# EAGLE design segment (EAGLE 7.1.0)
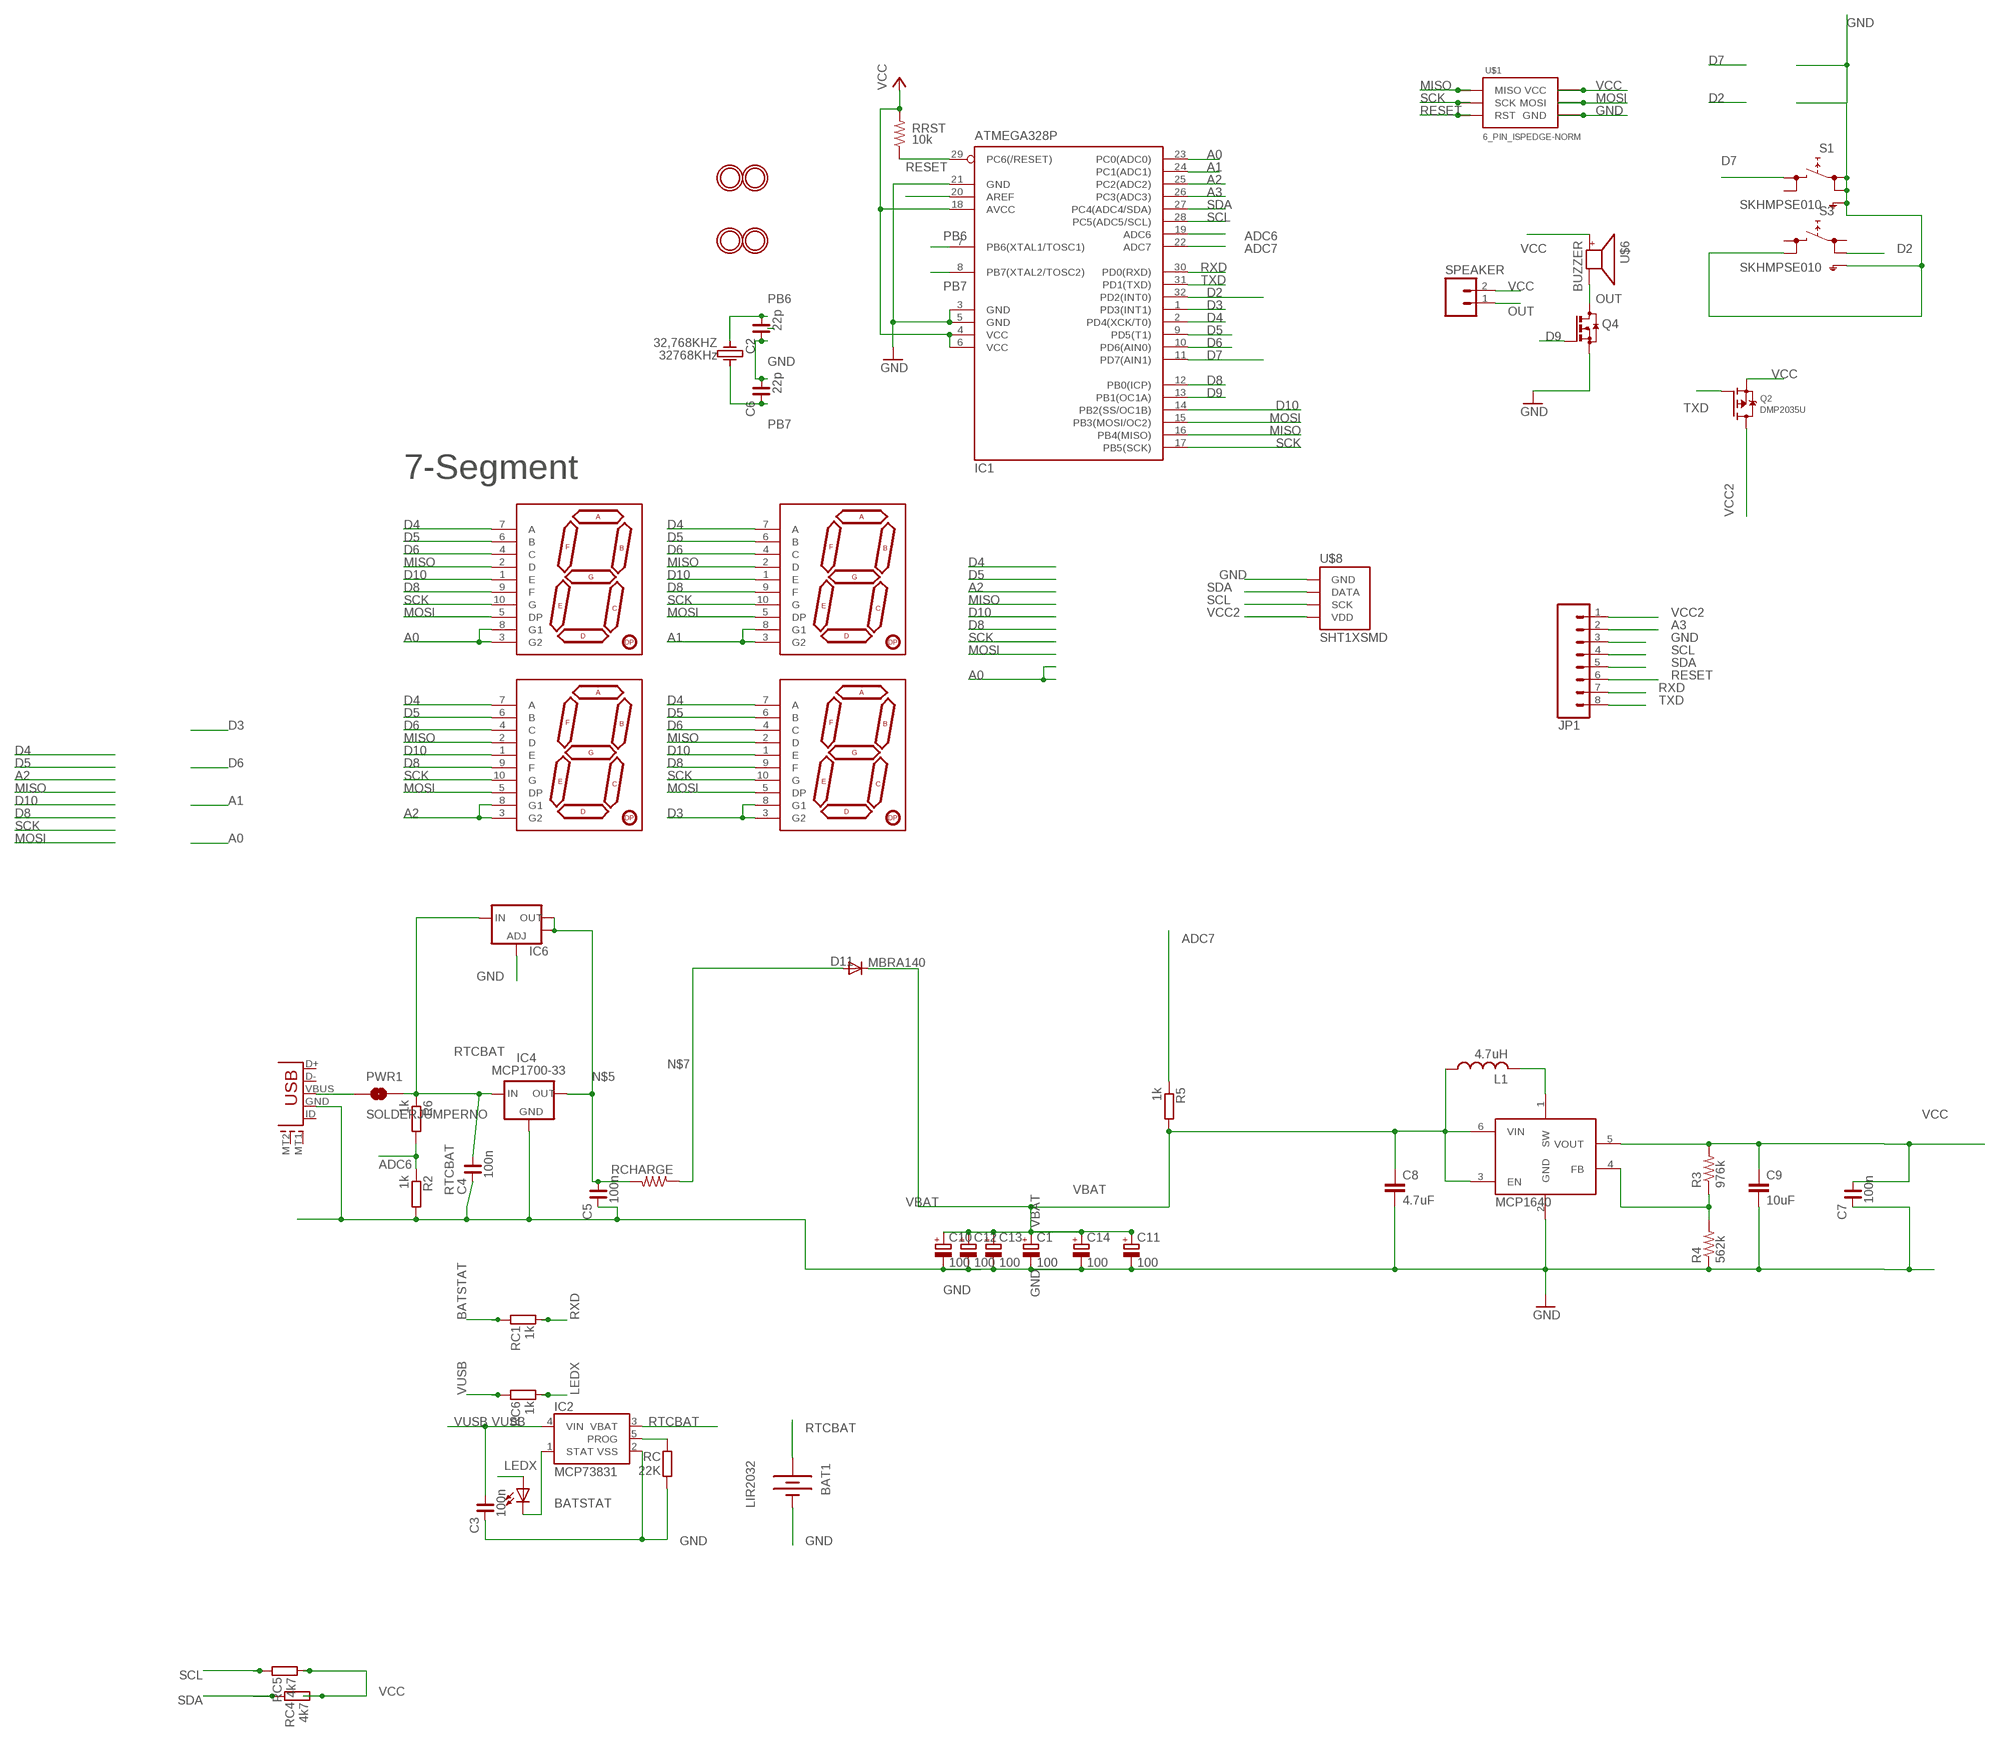
[diagram p0: schematic, sheet 1]

## Parts
32,768KHZ  32768KHz  CRYSTALL  [KX-327LT]
BAT1  LIR2032  BATTERYBATTCOM_20MM_PTH_SMT  [BATTCOM_20MM_PTH_SMT]
C1  100  CPOL-EUTT5D11L  [TT5D11L]
C2  22p  C_0603  [C0603]
C3  100n  C_0603  [C0603]
C4  100n  C_0603  [C0603]
C5  100n  C_0603  [C0603]
C6  22p  C_0603  [C0603]
C7  100n  C_0603  [C0603]
C8  4.7uF  CAP0805  [0805]
C9  10uF  CAP0805  [0805]
C10  100  CPOL-EUTT5D11L  [TT5D11L]
C11  100  CPOL-EUTT5D11L  [TT5D11L]
C12  100  CPOL-EUTT5D11L  [TT5D11L]
C13  100  CPOL-EUTT5D11L  [TT5D11L]
C14  100  CPOL-EUTT5D11L  [TT5D11L]
CHG  0805  LEDCHIPLED_0603  [CHIPLED_0603]
D11  MBRA140  DIODESOD  [SOD-323]
DIG1  7-SEGMENT-DISPLAY-1"-RED  [7-SEGMENT-SMD]
DIG2  7-SEGMENT-DISPLAY-1"-RED  [7-SEGMENT-SMD]
DIG3  7-SEGMENT-DISPLAY-1"-RED  [7-SEGMENT-SMD]
DIG4  7-SEGMENT-DISPLAY-1"-RED  [7-SEGMENT-SMD]
IC1  ATMEGA328P  MEGA8-AI  [TQFP32-08]
IC2  MCP73831  [SOT23-5]
IC4  MCP1700-33  MCP1700SOT233  [SOT23]
IC6  V_REG_LM1117SOT223  [SOT223]
JP1  M08NO_SILK  [1X08_PIN1_NO_SILK]
L1  4.7uH  LLQH44P_P0  [LQH44]
PWR1  SOLDERJUMPERNO  [SJ_2S-NO]
Q2  DMP2035U  MOSFET-PWIDE  [SOT23-WIDE]
Q4  BSS123  [SOT23]
R2  1k  R-EU_R0603  [R0603]
R3  976k  RESISTOR0603-RES  [0603-RES]
R4  562k  RESISTOR0603-RES  [0603-RES]
R5  1k  R-EU_R0603  [R0603]
R6  1k  R-EU_R0603  [R0603]
RC  22K  R-EU_R0603  [R0603]
RC1  1k  R-EU_R0603  [R0603]
RC4  4k7  R-EU_R0603  [R0603]
RC5  4k7  R-EU_R0603  [R0603]
RC6  1k  R-EU_R0603  [R0603]
RCHARGE  RESISTOR1206  [1206]
RRST  10k  R-US_R0603  [R0603@1]
S1  SKHMPSE010  [SKHMPXE010]
S3  SKHMPSE010  [SKHMPXE010]
SPEAKER  M02PTH  [1X02]
U2  MCP1640  [SOT23-6]
U$1  6_PIN_ISPEDGE-NORM  [6_PIN_EDGE]
U$2  MOUNTINGHOLE2.0  [MOUNTINGHOLE_2.0_PLATED]
U$3  MOUNTINGHOLE2.0  [MOUNTINGHOLE_2.0_PLATED]
U$4  MOUNTINGHOLE2.0  [MOUNTINGHOLE_2.0_PLATED]
U$5  MOUNTINGHOLE2.0  [MOUNTINGHOLE_2.0_PLATED]
U$6  BUZZER  [SMT-8585-BUZZER]
U$8  SHT1XSMD  [SHT1X]
USB2  USB-MICROBLARGEPAD  [USB-MICROB_LARGEPAD]

## Nets
A0: DIG1.3(G2) DIG1.8(G1) IC1.23(PC0(ADC0))
A1: DIG2.3(G2) DIG2.8(G1) IC1.24(PC1(ADC1))
A2: DIG3.3(G2) DIG3.8(G1) IC1.25(PC2(ADC2))
A3: IC1.26(PC3(ADC3)) JP1.2
ADC6: IC1.19(ADC6) R2.1 R6.2
ADC7: IC1.22(ADC7) R5.1
AREF: IC1.20(AREF)
BATSTAT: CHG.C IC2.1(STAT) RC1.2
D2: IC1.32(PD2(INT0)) S3.2(1.2)
D3: DIG4.3(G2) DIG4.8(G1) IC1.1(PD3(INT1))
D4: DIG1.7(A) DIG2.7(A) DIG3.7(A) DIG4.7(A) IC1.2(PD4(XCK/T0))
D5: DIG1.6(B) DIG2.6(B) DIG3.6(B) DIG4.6(B) IC1.9(PD5(T1))
D6: DIG1.4(C) DIG2.4(C) DIG3.4(C) DIG4.4(C) IC1.10(PD6(AIN0))
D7: IC1.11(PD7(AIN1)) S1.3(2.1)
D8: DIG1.9(F) DIG2.9(F) DIG3.9(F) DIG4.9(F) IC1.12(PB0(ICP))
D9: IC1.13(PB1(OC1A)) Q4.1(G)
D10: DIG1.1(E) DIG2.1(E) DIG3.1(E) DIG4.1(E) IC1.14(PB2(SS/OC1B))
GND [pwr]: BAT1.P$1(-) C1.- C2.2 C3.2 C4.2 C5.2 C6.1 C7.2 C8.2 C9.2 C10.- C11.- C12.- C13.- C14.- IC1.3(GND) IC1.5(GND) IC1.21(GND) IC2.2(VSS) IC4.1(GND) IC6.1(ADJ) JP1.3 Q4.2(S) R2.2 R4.1 RC.1 S1.1(1.1) S1.2(1.2) S1.5(SH) S3.4(2.2) S3.5(SH) U2.2(GND) U$1.6(GND) U$8.1(GND) USB2.GND
LEDX: CHG.A RC6.1
MISO: DIG1.2(D) DIG2.2(D) DIG3.2(D) DIG4.2(D) IC1.16(PB4(MISO)) U$1.1(MISO)
MOSI: DIG1.5(DP) DIG2.5(DP) DIG3.5(DP) DIG4.5(DP) IC1.15(PB3(MOSI/OC2)) U$1.4(MOSI)
N$2: IC2.5(PROG) RC.2
N$4: L1.P$2 U2.1(SW)
N$5: C5.1 IC4.2(OUT) IC6.2(OUT) IC6.4(OUT) RCHARGE.2
N$6: R3.1 R4.2 U2.4(FB)
N$7: D11.2(A) RCHARGE.1
OUT: Q4.3(D) SPEAKER.1 U$6.-
PB6: 32,768KHZ.4 C2.1 IC1.7(PB6(XTAL1/TOSC1))
PB7: 32,768KHZ.1 C6.2 IC1.8(PB7(XTAL2/TOSC2))
RESET: IC1.29(PC6(/RESET)) JP1.6 RRST.1 U$1.5(RST)
RTCBAT: BAT1.P$2(+) C4.1 IC2.3(VBAT) IC4.3(IN) IC6.3(IN) PWR1.2 R6.1
RXD: IC1.30(PD0(RXD)) JP1.7 RC1.1
SCK: DIG1.10(G) DIG2.10(G) DIG3.10(G) DIG4.10(G) IC1.17(PB5(SCK)) U$1.3(SCK)
SCL: IC1.28(PC5(ADC5/SCL)) JP1.4 RC5.2 U$8.3(SCK)
SDA: IC1.27(PC4(ADC4/SDA)) JP1.5 RC4.2 U$8.2(DATA)
TXD: IC1.31(PD1(TXD)) JP1.8 Q2.1(G)
VBAT [pwr]: C1.+ C8.1 C10.+ C11.+ C12.+ C13.+ C14.+ D11.1(C) L1.P$1 R5.2 U2.3(EN) U2.6(VIN)
VCC [vcc]: C7.1 C9.1 IC1.4(VCC) IC1.6(VCC) IC1.18(AVCC) Q2.2(S) R3.2 RC4.1 RC5.1 RRST.2 SPEAKER.2 U2.5(VOUT) U$1.2(VCC) U$6.+
VCC2: JP1.1 Q2.3(D) U$8.4(VDD)
VUSB: C3.1 IC2.4(VIN) PWR1.1 RC6.2 USB2.VBUS
Unconnected: S1.4(2.2) S3.1(1.1) S3.3(2.1) USB2.D+ USB2.D- USB2.ID USB2.MT1(SHEILD1) USB2.MT2(SHEILD2)

## Notes on the sheet
- 7-Segment

## Library data of the parts
32,768KHZ = es:CRYSTALL
BAT1 = SparkFunNew:BATTERY: Battery Holders Various common sizes : AA, AAA, 20mm coin cell and 12mm coin cell.
C1 C10-C14 = resistor:CPOL-EU: POLARIZED CAPACITOR, European symbol
C2-C7 = rc-master-smd:C_: NON-POLARIZED CAP
C8 C9 = SparkFun:CAP: Capacitor Standard 0603 ceramic capacitor, and 0.1" leaded capacitor.
CHG = led:LED: LED OSRAM: - CHIPLED LG R971, LG N971, LY N971, LG Q971, LY Q971, LO R971, LY R971 LH N974, LH R974 LS Q976, LO Q976, LY Q976 LO Q996 - Hyper CHIPLED LW Q18S LB Q993, LB Q99A, LB R99A - SideLED LS A670, LO A670, LY A670, LG A670, LP A670 LB A673, LV A673, LT A673, LW A673 LH A674 LY A675 LS A676, LA A676, LO A676, LY A676, LW A676 LS A679, LY A679, LG A679 - Hyper Micro SIDELED® LS Y876, LA Y876, LO Y876, LY Y876 LT Y87S - SmartLED LW L88C, LW L88S LB L89C, LB L89S, LG L890 LS L89K, LO L89K, LY L89K LS L896, LA L896, LO L896, LY L896 - TOPLED LS T670, LO T670, LY T670, LG T670, LP T670 LSG T670, LSP T670, LSY T670, LOP T670, LYG T670 LG T671, LOG T671, LSG T671 LB T673, LV T673, LT T673, LW T673 LH T674 LS T676, LA T676, LO T676, LY T676, LB T676, LH T676, LSB T676, LW T676 LB T67C, LV T67C, LT T67C, LS T67K, LO T67K, LY T67K, LW E67C LS E67B, LA E67B, LO E67B, LY E67B, LB E67C, LV E67C, LT E67C LW T67C LS T679, LY T679, LG T679 LS T770, LO T770, LY T770, LG T770, LP T770 LB T773, LV T773, LT T773, LW T773 LH T774 LS E675, LA E675, LY E675, LS T675 LS T776, LA T776, LO T776, LY T776, LB T776 LHGB T686 LT T68C, LB T68C - Hyper Mini TOPLED® LB M676 - Mini TOPLED Santana® LG M470 LS M47K, LO M47K, LY M47K Source: http://www.osram.convergy.de LUXEON: - LUMILED® LXK2-PW12-R00, LXK2-PW12-S00, LXK2-PW14-U00, LXK2-PW14-V00 LXK2-PM12-R00, LXK2-PM12-S00, LXK2-PM14-U00 LXK2-PE12-Q00, LXK2-PE12-R00, LXK2-PE12-S00, LXK2-PE14-T00, LXK2-PE14-U00 LXK2-PB12-K00, LXK2-PB12-L00, LXK2-PB12-M00, LXK2-PB14-N00, LXK2-PB14-P00, LXK2-PB14-Q00 LXK2-PR12-L00, LXK2-PR12-M00, LXK2-PR14-Q00, LXK2-PR14-R00 LXK2-PD12-Q00, LXK2-PD12-R00, LXK2-PD12-S00 LXK2-PH12-R00, LXK2-PH12-S00 LXK2-PL12-P00, LXK2-PL12-Q00, LXK2-PL12-R00 Source: www.luxeon.com KINGBRIGHT: KA-3528ASYC Source: www.kingbright.com
D11 = SparkFun:DIODE: Diode These are standard reverse protection diodes and small signal diodes. SMA package can handle up to about 1A. SOD-323 can handle about 200mA. What the SOD-323 package when ordering, there are some mfgs out there that are 5-pin packages.
DIG1-DIG4 = balto:7-SEGMENT-DISPLAY-1"-RED: 7-Segment Display 1" Red (COM-08546)
IC1 = atmel:MEGA8: MICROCONTROLLER 8 Kbytes FLASH, 1 kbytes SRAM, 512 bytes EEPROM, USART, 6-channel 10 bit ADC, 2-channel 8 bit ADC Pin compatible with Atmega48, ATMega88, ATMega168 Source: avr.lbr; MPN: ATMEGA8-16AU; OC_FARNELL: 9171371; OC_NEWARK: 73M8863
IC2 = SparkFunNew:MCP73831: Microchip's MCP73831 Miniature single cell, fully integrated Li-Ion, Li-polymer charge management controller http://ww1.microchip.com/downloads/en/DeviceDoc/21984a.pdf
IC4 = adafruit:MCP1700: VOLTAGE REGULATOR
IC6 = SparkFun:V_REG_LM1117: Voltage Regulator LM1117 Standard adjustable voltage regulator but in SMD form. Spark Fun Electronics SKU : COM-00595
JP1 = SparkFun-Connectors:M08: Header 8 Standard 8-pin 0.1" header. Use with straight break away headers (SKU : PRT-00116), right angle break away headers (PRT-00553), swiss pins (PRT-00743), machine pins (PRT-00117), and female headers (PRT-00115).
L1 = karlnet-parts:L
PWR1 = SparkFun:SOLDERJUMPER: Solder Jumper Standard SMD solder jumper. Used to automate production. Two varients : Normally Open and Normally Closed are the same, but have different paste layers. NC will have a large amount of paste and should jumper during reflow.
Q2 = microbuilder:MOSFET-P: P-Channel Mosfet LEGEND VDS: Voltage Drain-Source ID: Drain Current RDS(ON): Drain-Source On-State Resistance VGS(TH): Gate-Source Threshold Voltage CISS: Drain-Source Input Capacitance SOT-23 Name VDS ID RDS(ON) VGS(TH) CISS Order Number IRLML5103 30V 760mA 600 mOhm -- 75pF @ 25V Digikey: IRLML5103PBFCT-ND IRLML6401 12V 4.3A 50 mOhm 950mV @ 250µA 830pF @ 10V Digikey: IRLML6401PBFTR-ND NTR0202PL 20V 400mA 800 mOhm 2.3V @ 250uA 70pF @ 5V Digikey: NTR0202PLT1GOSTR-ND NTR4101PT1G 20V 1.8A 85 mOhm 1.2V @ 250uA 675pF @ 10V Digikey: NTR4101PT1GOSCT-ND DMP2004K 20V 600mA 900 mOhm 1V @ 250uA 175pF @ 16V Digikey: DMP2004KDICT-ND PMV65XP 20V 3.9A 76 mOhm 950mV @ 1mA 725pF @ 20V Digikey: 568-2358-2-ND TO-252 Name VDS ID RDS(ON) VGS(TH) CISS Order Number AOD417 30V 25A 34 mOhm 3V @ 250µA 920pF @ 15V Digikey: 785-1106-2-ND
Q4 = transistor-small-signal:BSS123: N-CHANNEL MOS FET
R2 R5 R6 RC RC1 RC4-RC6 = rcl:R-EU_: RESISTOR, European symbol
R3 R4 RCHARGE = SparkFun:RESISTOR: Resistor Basic schematic elements and footprints for 0603, 1206, and PTH resistors.
RRST = rcl:R-US_: RESISTOR, American symbol
S1 S3 = switch:SKHMP*E010: 6.2 X 6.5mm TACT Switch (SMD) Source: http://www3.alps.co.jp/WebObjects/catalog.woa/PDF/E/Switch/Tact/SKHM/SKHM.PDF
SPEAKER = SparkFun-Connectors:M02: Header 2 Standard 2-pin 0.1" header. Use with straight break away headers (SKU : PRT-00116), right angle break away headers (PRT-00553), swiss pins (PRT-00743), machine pins (PRT-00117), and female headers (PRT-00115). Molex polarized connector foot print use with SKU : PRT-08233 with associated crimp pins and housings.
U2 = karlnet-parts:MCP1640: MCP1623, 1624, 1640/B/C/D pwm/pfm or pwm only DC/DC converters, in SOT-23
U$1 = ppeter:6_PIN_ISP: AVR 6 PIN ISP header Edge connector normal layout
U$2-U$5 = microbuilder:MOUNTINGHOLE: Mounting Hole
U$6 = adafruit:BUZZER
U$8 = SparkFun-Sensors:SHT1X: SHT1x Humdity Sensor Sensirion humdity sensor. Schematic element and footprint proven. Spark Fun Electronics SKU : COM-08227
USB2 = zak:USB-MICROB

## Net classes
0 default: width 0.229 mm, drill 0.356 mm, clearance 0.229 mm
1 vcc: width 0.254 mm, drill 0.356 mm, clearance 0.229 mm
2 pwr: width 0.305 mm, drill 0.356 mm, clearance 0.229 mm

## Board
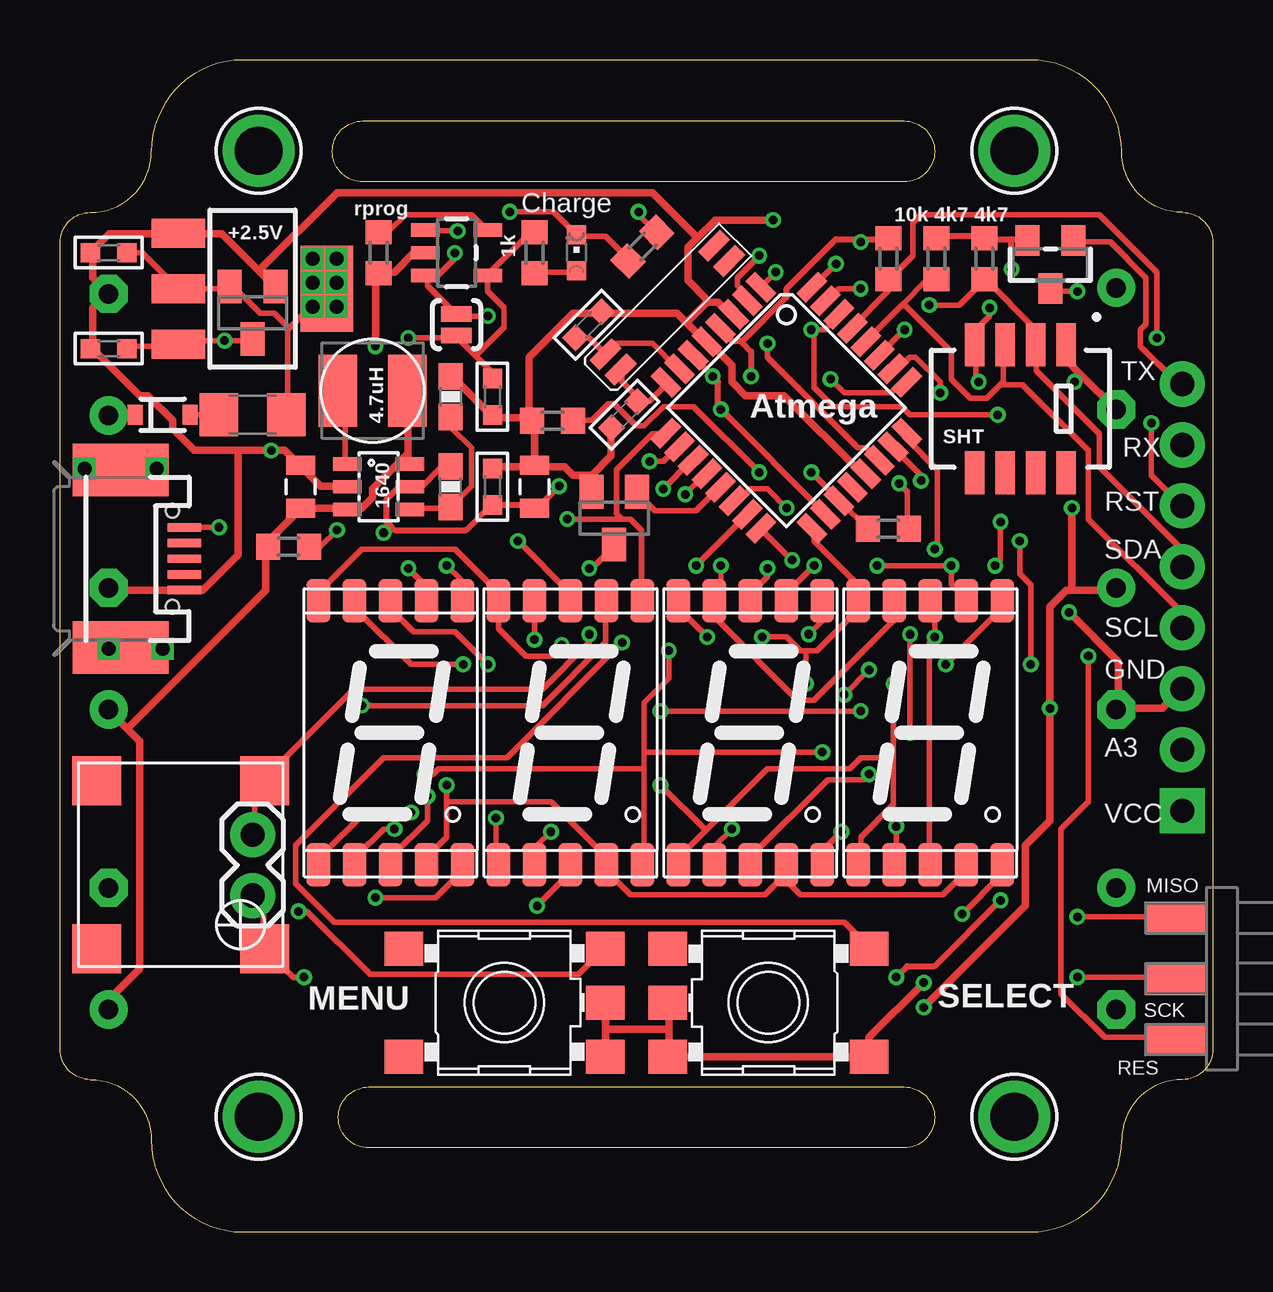
[diagram p1: board, top side]
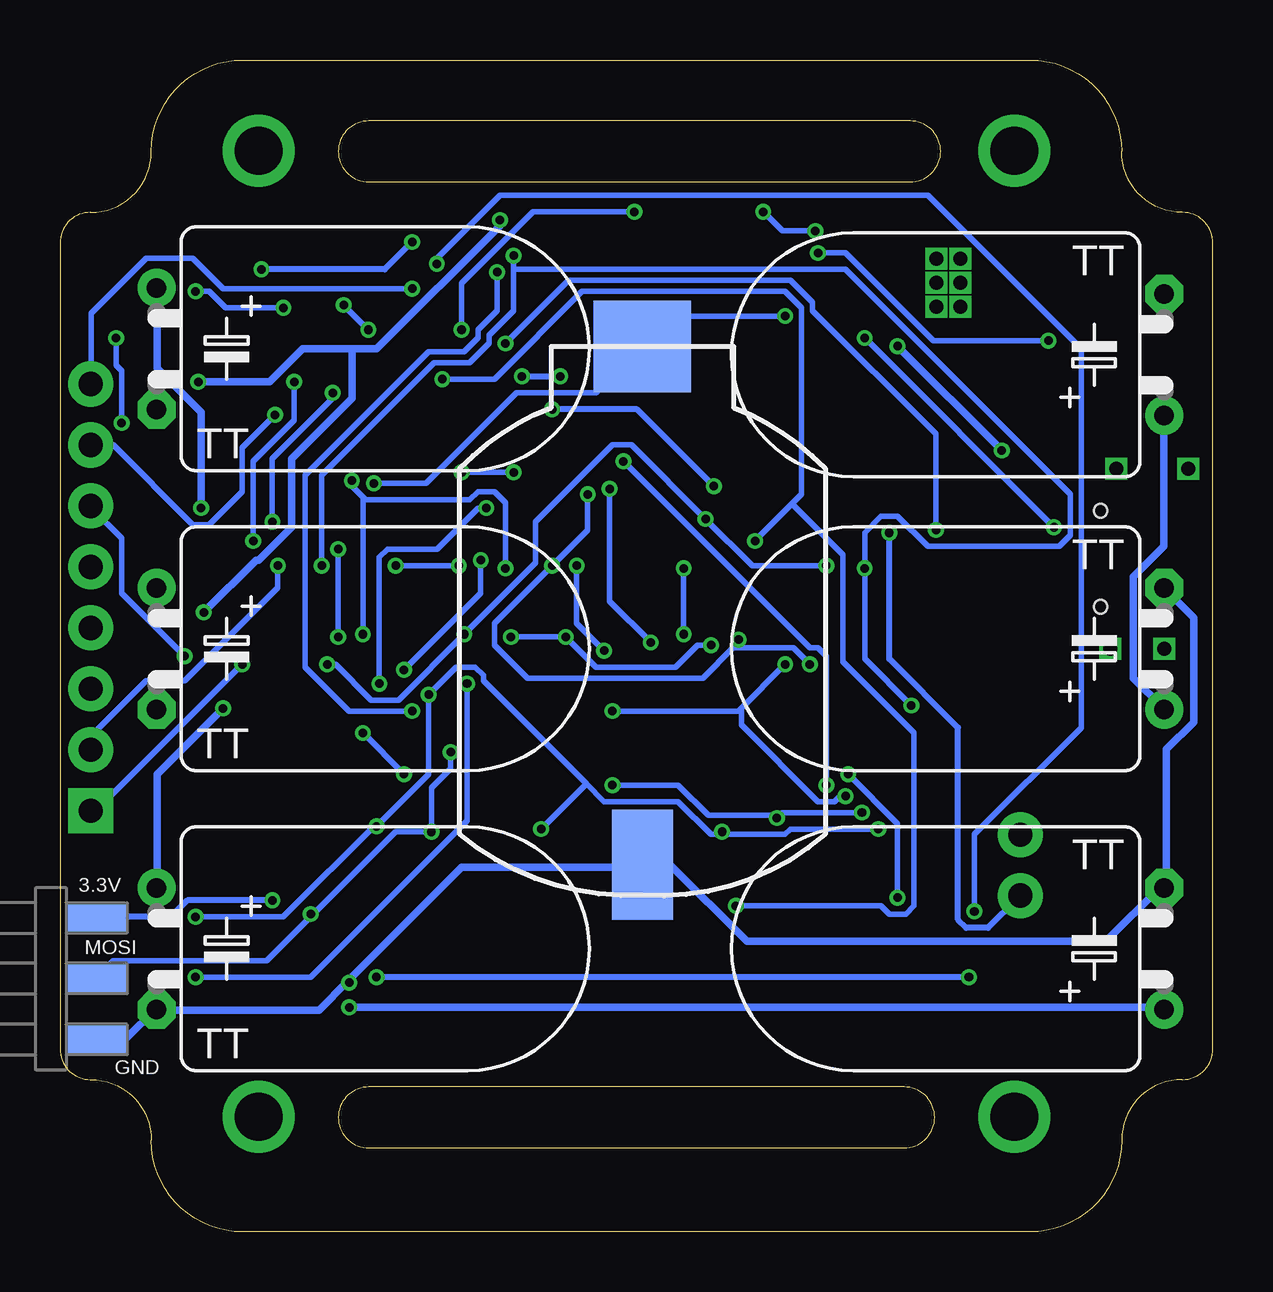
[diagram p2: board, bottom side, seen from below]

Size 48.06 x 48.83 mm. Coordinates in mm from the lower left corner, seen from the top.
Outline: 46.79,42.48 arc-90 48.06,41.21 48.06,7.62 arc-90 46.79,6.35 arc90 44.25,3.81 arc-90 40.44,0 7.62,0 arc-90 3.81,3.81 arc90 1.27,6.35 arc-90 0,7.62 0,41.21 arc-90 1.27,42.48 arc90 3.81,45.02 arc-90 7.62,48.83 40.44,48.83 arc-90 44.25,45.02 arc90 46.79,42.48
Outline: 35.19,46.29 arc-90 36.46,45.02 arc-90 35.19,43.75 12.62,43.75 arc-90 11.35,45.02 arc-90 12.62,46.29 35.19,46.29
Outline: 35.19,6.04 arc-90 36.46,4.77 arc-90 35.19,3.5 12.87,3.5 arc-90 11.6,4.77 arc-90 12.87,6.04 35.19,6.04
Copper layers (1*16): Top 0.035mm / dielectric 1.5mm / Bottom 0.035mm
Design rules "ITEADstudio_DRC": minimum track width 6mil, minimum drill 12mil, track to track 6mil, track to pad 6mil, pad to pad 6mil, via to via 6mil, smd to smd 0mil, copper to edge 10mil, drill to drill 10mil, minimum pad ring 10mil, minimum via ring 6mil, stop-mask expansion 2mil, vias tented up to drill 100mil, thermal gap 10mil
tRestrict: area -0.5,43.5 to 49.8,52.1; area 0.8,-6.7 to 48.5,6
bRestrict: area -2,43.5 to 56,54.3; area -5,-2.5 to 54.3,6

### Footprints (pad centres in the part's own frame; a part is rotated, then mirrored left to right if it is on the bottom)
KX-327LT = smd 1.3 x 0.6: 1 -3.2,-0.5; 2 3.2,-0.5; 3 3.2,0.4; 4 -3.2,0.4
BATTCOM_20MM_PTH_SMT = smd 4.572 x 2.54: P$1 0,0 | smd 3.81 x 4.064: P$2 21.59,0
TT5D11L = drill 0.813 pad 1.6: + -2.54,0 | drill 0.813 pad 1.6 octagon: - 2.54,0
C0603 = smd 0.8 x 0.8: 1 -0.762,0; 2 0.762,0
0805 = smd 0.8 x 1.2: 1 -0.9,0; 2 0.9,0
CHIPLED_0603 = smd 0.8 x 0.8: A 0,-0.75; C 0,0.75
SOD-323 = smd 0.63 x 0.83: 1 -1.15,0; 2 1.15,0
7-SEGMENT-SMD = smd 1 x 1.8: 1 -3,-5.5; 2 -1.5,-5.5; 3 0,-5.5; 4 1.5,-5.5; 5 3,-5.5; 6 3,5.5; 7 1.5,5.5; 8 0,5.5; 9 -1.5,5.5; 10 -3,5.5
TQFP32-08 = smd 1.27 x 0.559: 1 -4.293,2.8; 2 -4.293,2; 3 -4.293,1.2; 4 -4.293,0.4; 5 -4.293,-0.4; 6 -4.293,-1.2; 7 -4.293,-2; 8 -4.293,-2.8; 17 4.293,-2.8; 18 4.293,-2; 19 4.293,-1.2; 20 4.293,-0.4; 21 4.293,0.4; 22 4.293,1.2; 23 4.293,2; 24 4.293,2.8 | smd 0.559 x 1.27: 9 -2.8,-4.293; 10 -2,-4.293; 11 -1.2,-4.293; 12 -0.4,-4.293; 13 0.4,-4.293; 14 1.2,-4.293; 15 2,-4.293; 16 2.8,-4.293; 25 2.8,4.293; 26 2,4.293; 27 1.2,4.293; 28 0.4,4.293; 29 -0.4,4.293; 30 -1.2,4.293; 31 -2,4.293; 32 -2.8,4.293
SOT23-5 = smd 0.55 x 1.2: 1 -0.95,-1.3; 2 0,-1.3; 3 0.95,-1.3; 4 0.95,1.3; 5 -0.95,1.3
SOT23 = smd 1 x 1.4: 1 -0.95,-1.1; 2 0.95,-1.1; 3 0,1.1
SOT223 = smd 1.219 x 2.235: 1 -2.311,-3.099; 2 0,-3.099; 3 2.311,-3.099 | smd 3.6 x 2.2: 4 0,3.099
1X08_PIN1_NO_SILK = drill 1.016 pad 1.88 square: 1 0,0 | drill 1.016 pad 1.88: 2 2.54,0; 3 5.08,0; 4 7.62,0; 5 10.16,0; 6 12.7,0; 7 15.24,0; 8 17.78,0
LQH44 = smd 1.6 x 3: P$1 -1.45,0; P$2 1.45,0
SJ_2S-NO = smd 0.635 x 1.27: 1 -0.45,0; 2 0.45,0
SOT23-WIDE = smd 1 x 1.27: 1 -0.95,-1; 2 0.95,-1; 3 0,1
R0603 = smd 1 x 1.1: 1 -0.85,0; 2 0.85,0
0603-RES = smd 1.1 x 1: 1 -0.85,0; 2 0.85,0
1206 = smd 1.6 x 1.8: 1 -1.4,0; 2 1.4,0
R0603@1 = smd 1 x 1.1: 1 -0.85,0; 2 0.85,0
SKHMPXE010 = smd 1.6 x 1.4: 1 -4.2,2.25; 2 4.2,2.25; 3 -4.2,-2.25; 4 4.2,-2.25; 5 4.2,0
1X02 = drill 1.016 pad 1.88: 1 0,0; 2 2.54,0
SOT23-6 = smd 0.55 x 1.2: 1 -0.95,-1.3; 2 0,-1.3; 3 0.95,-1.3; 4 0.95,1.3; 5 0,1.3; 6 -0.95,1.3
6_PIN_EDGE = smd 1.27 x 2.54: 1 2.54,0; 3 0,0; 5 -2.54,0 | smd 1.27 x 2.54 bottom: 2 2.54,0; 4 0,0; 6 -2.54,0
MOUNTINGHOLE_2.0_PLATED = drill 2 pad 3: P$1 0,0
SMT-8585-BUZZER = smd 2.05 x 2.05: + -3.5,-3.5; - 3.5,-3.5; NC1 -3.5,3.5; NC2 3.5,3.5
SHT1X = smd 1.8 x 0.8: 1 -2.667,1.905; 2 -2.667,0.635; 3 -2.667,-0.635; 4 -2.667,-1.905; 5 2.667,-1.905; 6 2.667,-0.635; 7 2.667,0.635; 8 2.667,1.905
USB-MICROB_LARGEPAD = smd 0.35 x 1.4: D+ 0,2.65; D- -0.65,2.65; GND 1.3,2.65; ID 0.65,2.65; VBUS -1.3,2.65 | smd 2.2 x 4: MT1 -3.7,0; MT2 3.7,0 | hole 0.55: -2,2.15; 2,2.15

### Placement (x,y rotation side)
32,768KHZ  25.28,38.55 45 top
BAT1  23.78,15.3 90 bottom
C1  2.03,36.55 90 bottom
C2  22.03,37.8 45 top
C3  18.03,34.8 270 top
C4  2.03,36.8 180 top
C5  2.03,40.8 180 top
C6  23.53,34.05 45 top
C7  18.03,31.05 90 top
C8  10.03,31.05 90 top
C9  19.78,31.05 90 top
C10  2.03,24.3 90 bottom
C11  2.03,11.8 90 bottom
C12  44.03,24.3 270 bottom
C13  44.03,36.8 270 bottom
C14  44.03,11.8 270 bottom
CHG  21.53,40.8 0 top
D11  4.28,34.05 0 top
DIG1  28.78,20.8 0 top
DIG2  36.28,20.8 0 top
DIG3  21.28,20.8 0 top
DIG4  13.78,20.8 0 top
IC1  30.28,34.34 315 top
IC2  16.53,40.8 270 top
IC4  8.03,38.3 180 top
IC6  8.03,39.3 270 top
JP1  46.78,17.55 90 top
L1  13.03,35.05 180 top
PWR1  16.53,37.8 90 top
Q2  41.28,40.3 180 top
Q4  23.1,29.74 180 top
R2  20.53,33.8 180 top
R3  16.28,31.05 90 top
R4  16.28,34.8 270 top
R5  9.53,28.55 180 top
R6  34.53,29.3 180 top
RC  13.28,40.8 90 top
RC1  24.28,41.05 225 top
RC4  38.53,40.55 270 top
RC5  36.53,40.55 270 top
RC6  19.78,40.8 90 top
RCHARGE  8.03,34.05 0 top
RRST  34.53,40.55 90 top
S1  29.53,9.55 180 top
S3  18.53,9.55 0 top
SPEAKER  8.03,16.55 270 top
U2  13.28,31.05 270 top
U$1  46.53,10.55 90 top
U$2  39.78,45.05 0 top
U$3  8.28,4.8 0 top
U$4  39.78,4.8 0 top
U$5  8.28,45.05 0 top
U$6  5.03,15.3 90 top
U$8  40.03,34.3 270 top
USB2  2.53,28.05 270 top

### Tracks (layer width: path | path; a pad name or v marks a point on that pad's centre or on a via)
A0  (via drill 0.36)
  Top 0.229: v35.89,31.3 35.89,31.53 34.75,32.68 IC1.23 | v29.49,27.65 29.49,27.3 28.81,26.62 28.81,26.39 DIG1.8 | v33.72,19.07 33.49,18.85 32.01,18.85 28.81,15.64 28.81,15.3 DIG1.3 | v35.43,24.9 v35.43,20.79
  Bottom 0.229: v35.89,31.3 35.89,31.07 35.38,30.56 | 35.38,30.56 35.32,30.5 30.98,30.5 30.63,30.85 29.95,30.85 29.49,30.39 v29.49,27.65 | v35.43,20.79 v33.72,19.07 | v35.43,24.9 35.43,30.5 35.38,30.56
A1  (via drill 0.36)
  Top 0.229: v36.46,28.45 36.58,28.56 36.58,31.76 35.32,33.02 35.32,33.25 IC1.24 | DIG2.8 36.35,26.28 36.46,26.16 v36.46,24.79 36.23,24.56 36.23,15.3 DIG2.3
  Bottom 0.229: v36.46,24.79 v36.46,28.45
A2  (via drill 0.36)
  Top 0.229: v32.12,35.53 32.69,34.96 34.63,34.96 34.98,35.3 35.21,35.3 IC1.25 | v19.09,28.79 21.26,26.62 21.26,26.39 DIG3.8 | v19.89,13.59 21.26,14.96 21.26,15.19 DIG3.3
  Bottom 0.229: v32.12,35.53 29.95,35.53 26.29,39.19 17.83,39.19 17.15,38.5 17.15,30.73 17.55,30.33 | v19.09,28.79 17.55,30.33 | v19.89,13.59 13.83,13.59 13.49,13.25 12.8,13.25 12.46,13.59 12.46,20.79 15.43,23.76 15.43,28.22 17.55,30.33
A3  (via drill 0.36)
  Top 0.229: v36.69,34.96 36.69,35.42 35.66,36.45 35.43,36.45 34.98,35.99 34.75,35.99 IC1.26 | v39.21,29.59 39.21,27.99 v38.98,27.76
  Bottom 0.229: v36.69,34.96 36.69,34.73 39.21,32.22 v39.21,29.59 | v38.98,27.76 38.98,26.85 42.86,22.96 44.46,22.96 46.75,20.67 46.75,20.1 JP1.2
ADC6  (via drill 0.36)
  Top 0.229: R6.2 33.61,29.36 32.58,30.39 IC1.19 32.46,30.5 v31.32,31.65 | v29.15,31.65 26.4,34.39 25.15,34.39 24.35,33.59 24,33.59 23.09,34.5 22.86,34.5 22.18,33.82 21.49,33.82 R2.1
  Bottom 0.229: v31.32,31.65 v29.15,31.65
ADC7  (via drill 0.36)
  Top 0.229: v11.55,29.25 10.86,28.56 10.4,28.56 R5.1 | v29.49,37.02 29.49,36.45 33.26,32.68 33.61,32.68 34.06,32.22 IC1.22
  Bottom 0.229: v11.55,29.25 11.55,33.25 16.69,38.39 16.69,38.73 17.6,39.65 26.86,39.65 v29.49,37.02
BATSTAT  (via drill 0.36)
  Top 0.229: RC1.2 23.66,40.56 22.75,41.48 21.6,41.48 CHG.C 21.49,41.59 20.58,42.5 v18.75,42.5 | v16.58,41.7 15.32,41.7 IC2.1
  Bottom 0.229: v16.58,41.7 17.95,41.7 v18.75,42.5
D2  (via drill 0.36)
  Top 0.229: v32.35,40.33 31.43,39.42 IC1.32 | v9.95,13.36 10.29,13.36 12.92,10.73 21.6,10.73 22.63,11.76 S3.2
  Bottom 0.229: v32.35,40.33 32.35,40.56 29.72,43.19 11.89,43.19 5.49,36.79 5.49,21.02 9.95,16.56 v9.95,13.36
D3  (via drill 0.36)
  Top 0.229: v29.83,39.99 29.26,39.42 IC1.1 | v25.03,21.7 v33.38,21.7 | v17.83,23.65 16.46,25.02 14.75,25.02 13.83,25.93 13.83,26.28 DIG4.8 | v15.32,18.16 15.32,17.13 13.83,15.64 13.83,15.3 DIG4.3
  Bottom 0.229: v29.83,39.99 29.83,38.39 30.63,37.59 30.63,37.25 31.21,36.68 32.69,36.68 37.83,31.53 37.83,23.53 36.01,21.7 v33.38,21.7 | v25.03,21.7 19.78,21.7 19.72,21.76 | v17.83,23.65 19.72,21.76 | v15.32,18.16 15.55,18.16 15.77,17.93 16.46,17.93 19.66,21.13 19.66,21.7 19.72,21.76
D4  (via drill 0.36)
  Top 0.229: v14.52,27.65 15.2,26.96 15.2,26.39 DIG4.7 | v12.57,21.93 20.12,21.93 22.75,24.56 22.75,26.28 DIG3.7 | v29.15,40.68 28.23,39.76 28.23,39.42 28.58,39.08 28.58,38.85 IC1.2 | DIG2.7 37.72,26.39 37.15,26.96 v37.15,27.76 v34.06,27.76 | v31.43,27.76 30.29,26.62 30.29,26.39 DIG1.7
  Bottom 0.229: v12.57,21.93 14.52,23.88 v14.52,27.65 14.52,29.13 13.83,29.82 13.15,29.82 11.89,28.56 6.4,28.56 5.95,29.02 5.95,30.73 15.32,40.1 29.15,40.1 | 29.15,40.1 29.15,38.39 30.18,37.36 30.18,37.02 30.98,36.22 32.46,36.22 37.15,31.53 v37.15,27.76 | 29.15,40.1 v29.15,40.68 | v34.06,27.76 v31.43,27.76
D5  (via drill 0.36)
  Top 0.229: 23.38,29.76 23.43,29.7 23.78,29.7 24.23,29.25 24.23,26.39 DIG3.6 | 23.38,29.76 23.2,29.93 23.2,31.76 24.69,33.25 25.26,33.25 IC1.9 | v16.12,27.76 16.69,27.19 16.69,26.39 DIG4.6 | v21.15,29.7 23.32,29.7 23.38,29.76 | v31.21,24.9 31.78,25.48 31.78,26.28 DIG1.6 | v36.92,23.65 39.21,25.93 39.21,26.28 DIG2.6
  Bottom 0.229: v16.12,27.76 19.2,27.76 v21.15,29.7 24.23,32.79 25.03,32.79 28.23,29.59 28.23,27.88 v31.21,24.9 33.95,22.16 35.09,22.16 36.58,23.65 v36.92,23.65
D6  (via drill 0.36)
  Top 0.229: v24.58,32.1 25.15,32.1 25.72,32.68 IC1.10 | 16.12,17.93 16.12,16.45 15.32,15.64 15.32,15.3 DIG4.4 | 16.12,17.93 v16.12,18.62 | 16.12,17.93 20.46,17.93 22.75,15.64 22.75,15.3 DIG3.4 22.86,15.19 22.86,14.96 23.78,14.04 29.38,14.04 30.18,14.85 30.18,15.19 DIG1.4 30.18,14.73 30.86,14.04 36.81,14.04 37.72,14.96 37.72,15.19 DIG2.4
  Bottom 0.229: v24.58,32.1 16.8,24.33 16.46,24.33 16.12,23.99 v16.12,18.62
D7  (via drill 0.36)
  Top 0.229: v25.15,30.96 26.29,32.1 IC1.11 | v23.43,24.56 18.63,19.76 13.49,19.76 9.83,16.1 9.83,14.5 11.43,12.9 32.69,12.9 33.72,11.87 S1.3
  Bottom 0.229: v25.15,30.96 25.15,26.28 v23.43,24.56
D8  (via drill 0.36)
  Top 0.229: v26.06,30.73 26.86,31.53 IC1.12 | v27.55,27.76 27.55,26.62 27.32,26.39 DIG1.9 27.32,26.28 27.32,25.59 30.75,22.16 31.43,22.16 34.75,25.48 34.75,26.28 DIG2.9 | v16.8,23.65 14.63,23.65 12.35,25.93 12.35,26.28 DIG4.9 | v19.78,24.68 19.78,26.28 DIG3.9
  Bottom 0.229: v26.06,30.73 26.06,29.25 v27.55,27.76 29.95,25.36 29.95,24.45 28.58,23.07 21.26,23.07 20,24.33 19.78,24.33 | v16.8,23.65 17.49,24.33 19.78,24.33 | 19.78,24.33 v19.78,24.68
D9
  Top 0.229: IC1.13 27.43,30.96 26.52,30.05 24.8,30.05 24.12,30.73 Q4.1
D10  (via drill 0.36)
  Top 0.229: v14.63,17.47 12.69,17.47 10.86,15.64 10.86,15.3 DIG4.1 | v18.18,17.25 18.18,15.3 DIG3.1 | v30.29,30.16 29.49,30.96 28.81,30.96 28.35,30.5 28.12,30.5 IC1.14 | 34.75,19.76 34.75,17.82 33.38,16.45 33.38,15.3 DIG2.1 | 34.75,19.76 v34.75,22.85 | 26.92,16.73 29.49,19.3 32.92,19.3 33.38,19.76 34.75,19.76 | 26.92,16.73 25.83,15.64 25.83,15.3 DIG1.1 | 26.92,16.73 v25.03,18.62
  Bottom 0.229: v14.63,17.47 17.95,17.47 v18.18,17.25 18.18,17.36 21.03,17.36 22.29,18.62 v25.03,18.62 | v30.29,30.16 30.63,30.16 32.35,28.45 34.41,28.45 34.75,28.1 v34.75,22.85
GND  (via drill 0.36)
  Top 0.305: C6.1 22.98,33.48 22.98,32.33 22.18,31.53 22.18,30.85 Q4.2 22.06,31.53 21.38,31.53 21.03,31.88 19.89,31.88 C9.2 | C7.2 18.06,31.88 19.78,31.88 C9.2 | R2.2 19.66,33.82 19.55,33.93 18.06,33.93 C3.2 17.95,34.05 16.35,35.65 R4.1 | C9.2 19.78,31.99 19.78,33.7 R2.2 | JP1.3 46.75,22.62 45.95,21.82 44.12,21.82 C12.- 44.12,21.93 44.12,23.76 v42.06,25.82 | 42.58,35.7 44.01,34.28 C13.- | 42.58,35.7 41.95,36.33 41.95,36.9 U$8.1 | 28,38.28 IC1.3 27.89,38.28 27.43,38.73 26.98,38.73 | 33.49,31.65 IC1.21 33.38,31.65 30.18,34.85 28.58,34.85 28,35.42 28,36.1 27.09,37.02 IC1.5 | 26.12,37.88 26.86,37.13 IC1.5 | 26.12,37.88 25.72,38.28 22.63,38.28 C2.2 22.52,38.28 21.38,38.28 19.55,36.45 19.55,34.05 R2.2 | 26.98,37.13 IC1.5 | 26.12,37.88 26.98,38.73 | v42.29,35.42 42.58,35.7 | v29.72,42.16 27.32,42.16 26.58,41.42 | 26.58,41.42 26.18,41.02 26.18,39.65 26.98,38.85 26.98,38.73 | 22.75,8.44 22.75,9.47 S3.5 | 22.75,8.44 22.75,7.3 S3.4 | 25.38,8.44 25.38,9.47 S1.5 | 25.38,8.44 25.38,7.3 S1.2 25.49,7.3 S1.1 33.72,7.42 33.72,8.1 v36.01,10.39 | 25.38,8.44 22.75,8.44 | C10.- 2.06,26.73 5.14,26.73 USB2.GND 5.26,26.73 5.95,26.73 7.43,28.22 7.43,32.56 | 8.29,40.05 6.75,41.59 5.03,41.59 IC6.1 4.8,41.59 2.06,41.59 1.37,40.9 C5.2 1.37,40.79 1.37,39.76 1.94,39.19 C1.- 1.94,39.08 1.37,38.5 1.37,36.9 C4.2 1.37,36.79 3.32,34.85 3.66,34.85 4.69,33.82 4.69,33.48 5.6,32.56 7.43,32.56 | 8.29,40.05 8.92,39.42 IC4.1 | IC2.2 15.2,40.79 14.75,40.79 13.95,39.99 13.37,39.99 RC.1 13.15,39.88 v13.15,36.9 | U2.2 11.89,31.07 10.86,31.07 10.06,31.88 C8.2 9.95,31.99 9.37,32.56 v8.8,32.56 7.43,32.56 | 26.58,41.42 24.69,43.3 11.55,43.3 8.29,40.05
  Bottom 0.305: v42.29,35.42 39.32,35.42 37.95,36.79 35.89,36.79 | 35.89,36.79 34.86,36.79 29.72,41.93 v29.72,42.16 | v42.06,25.82 39.89,27.99 39.78,27.99 38.41,29.36 38.41,32.22 35.89,34.73 35.89,36.79 | 46.52,7.99 U$1.6 46.41,8.1 45.26,8.1 44.12,9.24 C14.- 43.89,9.24 37.26,9.24 36.06,10.44 | 36.06,10.44 31.32,15.19 23.89,15.19 BAT1.P$1 23.66,15.3 22.63,15.3 19.43,12.1 4.46,12.1 2.17,14.39 C11.- 1.94,14.39 1.94,20.1 0.8,21.25 0.8,25.59 1.94,26.73 C10.- | v36.01,10.39 36.06,10.44 | v8.8,32.56 v13.15,36.9
LEDX
  Top 0.229: CHG.A 21.49,39.99 19.89,39.99 RC6.1
MISO  (via drill 0.36)
  Top 0.229: v30.52,27.99 29.26,29.25 IC1.16 | v32.69,22.39 v33.72,23.42 | v34.86,16.9 34.86,15.3 DIG2.2 | v13.95,16.79 13.49,16.79 12.35,15.64 12.35,15.3 DIG4.2 | v20.46,16.67 19.89,16.1 19.89,15.3 DIG3.2 | v28,16.79 27.32,16.1 27.32,15.3 DIG1.2 | v42.41,13.13 46.52,13.13 U$1.1
  Bottom 0.229: v30.52,27.99 30.52,26.62 v33.72,23.42 | v13.95,16.79 17.6,16.79 17.83,16.56 20.46,16.56 | 20.46,16.56 20.92,16.56 22.29,17.93 25.38,17.93 26.12,18.67 | 26.12,18.67 30.41,22.96 30.41,23.19 30.75,23.53 31.55,23.53 v32.69,22.39 32.69,19.07 v34.86,16.9 34.86,17.02 38.75,13.13 v42.41,13.13 | 20.46,16.56 v20.46,16.67 | 26.12,18.67 v28,16.79
MOSI  (via drill 0.36)
  Top 0.229: v32.58,16.67 31.89,15.99 31.89,15.3 DIG1.5 | v37.61,13.25 39.21,14.85 39.21,15.19 DIG2.5 | v26.52,27.76 28.58,29.82 IC1.15 | v25.38,24.22 25.38,23.07 24.35,22.05 24.35,19.99 | 24.35,19.3 24.35,15.3 DIG3.5 | 24.35,19.3 24.35,19.99 | v13.15,13.93 15.66,13.93 16.69,14.96 16.69,15.19 DIG4.5 | v15.2,19.07 15.55,19.07 15.77,19.3 24.35,19.3 | 24.35,19.99 v31.78,19.99
  Bottom 0.229: 37.55,13.19 39.44,11.3 45.84,11.3 46.52,10.62 U$1.4 | 37.55,13.19 34.06,16.67 v32.58,16.67 32.58,18.5 31.78,19.3 v31.78,19.99 | v37.61,13.25 37.55,13.19 | v26.52,27.76 26.52,25.36 v25.38,24.22 | v13.15,13.93 13.15,17.02 v15.2,19.07
N$1  (via drill 0.6)
  other vias: 1.03,31.8
N$2
  Top 0.229: RC.2 13.37,41.7 13.72,41.7 14.4,42.39 17.15,42.39 17.72,41.82 IC2.5
N$3  (via drill 0.6)
  other vias: 4.03,31.8
N$4
  Top 0.229: U2.1 11.89,32.1 11.89,34.73 11.66,34.96 L1.P$2
N$5
  Top 0.229: C5.1 2.86,40.79 3.43,40.79 4.92,39.3 IC6.2 5.03,39.3 6.97,39.3 IC4.2 7.09,39.3 7.32,39.3 8.35,38.28 8.92,38.28 9.55,37.65 | 9.55,37.65 11.09,39.19 IC6.4 | 9.55,37.65 9.49,37.59 9.49,34.16 RCHARGE.2
N$6
  Top 0.229: U2.4 14.63,30.16 16.23,30.16 R3.1 16.35,30.28 17.15,31.07 17.15,32.68 16.35,33.48 16.35,33.93 R4.2
N$7
  Top 0.229: D11.2 5.49,34.05 6.52,34.05 RCHARGE.1
N$8  (via drill 0.6)
  other vias: 4.28,24.3
N$9  (via drill 0.6)
  other vias: 2.03,24.3
N$10  (via drill 0.6)
  other vias: 10.53,40.55
N$11  (via drill 0.6)
  other vias: 11.53,40.55
N$12  (via drill 0.6)
  other vias: 11.53,39.55
N$13  (via drill 0.6)
  other vias: 10.53,39.55
N$14  (via drill 0.6)
  other vias: 10.53,38.55
N$15  (via drill 0.6)
  other vias: 11.53,38.55
OUT  (via drill 0.36)
  Top 0.229: v22.06,27.65 22.18,27.65 23.09,28.56 Q4.3 | v22.06,24.9 22.06,24.56 20.12,22.62 12.23,22.62 8.46,18.85 U$6.- 8.46,18.73 8.12,18.39 8.12,16.56 SPEAKER.1
  Bottom 0.229: v22.06,24.9 v22.06,27.65
PB6
  Top 0.229: C2.1 21.6,37.25 22.06,37.25 22.63,36.68 32,768KHZ.4 22.75,36.68 23.09,37.02 24.69,37.02 25.72,35.99 IC1.7
PB7
  Top 0.229: IC1.8 25.26,35.3 24.58,34.62 24.12,34.62 C6.2 24.12,34.73 23.43,35.42 23.43,35.88 32,768KHZ.1
RESET  (via drill 0.36)
  Top 0.229: IC1.29 33.03,37.7 34.52,39.19 34.52,39.65 RRST.1 34.63,39.76 35.55,40.68 35.55,42.05 35.89,42.39 43.32,42.39 45.72,39.99 v45.72,37.25 | v45.49,33.7 45.49,31.53 46.75,30.28 JP1.6 | v42.86,23.99 42.86,17.93 41.72,16.79 41.72,9.93 43.55,8.1 46.52,8.1 U$1.5
  Bottom 0.229: v45.72,37.25 45.72,36.1 45.49,35.88 v45.49,33.7 | v42.86,23.99 45.49,26.62 45.49,28.9 46.75,30.16 JP1.6
RTCBAT  (via drill 0.36)
  Top 0.229: C4.1 2.86,36.9 4.92,36.9 IC6.3 5.03,37.02 5.14,37.13 v6.86,37.13 8,37.13 IC4.3 | v34.98,31.19 35.32,30.85 35.32,29.36 R6.1 | v17.83,38.16 16.58,38.16 PWR1.2 16.46,38.28 15.32,39.42 15.32,39.76 IC2.3 15.32,39.88 15.77,39.88 16.46,40.56 v16.46,40.79
  Bottom 0.229: v34.98,31.19 32.81,31.19 29.03,34.96 25.72,34.96 23.89,36.79 BAT1.P$2 23.78,36.9 22.52,38.16 v17.83,38.16 | v6.86,37.13 11.66,37.13 15.32,40.79 v16.46,40.79
RXD  (via drill 0.36)
  Top 0.229: v24.12,42.5 24.12,42.39 24.8,41.7 RC1.1 | 31.43,37.59 31.89,37.59 32.46,38.16 IC1.30 | v39.09,34.05 35.43,34.05 35.09,34.39 32.23,34.39 31.43,35.19 31.43,37.59 | 31.43,37.59 v31.32,37.59
  Bottom 0.229: v24.12,42.5 28.35,42.5 31.32,39.53 v31.32,37.59 | v39.09,34.05 40.46,32.68 40.46,30.85 41.84,29.48 42.52,29.48 45.84,32.79 46.75,32.79 JP1.7
SCK  (via drill 0.36)
  Top 0.229: DIG4.10 10.86,26.39 10.86,26.73 12.57,28.45 16.46,28.45 18.18,26.73 18.18,26.39 DIG3.10 18.29,26.28 18.29,25.13 19.43,23.99 20.46,23.99 v20.92,24.45 | IC1.17 31.43,29.25 31.43,28.79 33.26,26.96 33.26,26.39 DIG2.10 33.26,26.28 33.26,25.93 31.55,24.22 31.09,24.22 | v26.98,24.79 25.83,25.93 25.83,26.28 DIG1.10 | v29.26,24.79 30.29,24.79 30.86,24.22 31.09,24.22 | v42.41,10.62 46.52,10.62 U$1.3 | 31.09,24.22 v31.09,22.85
  Bottom 0.229: v29.26,24.79 v26.98,24.79 25.72,23.53 22.4,23.53 21.49,24.45 v20.92,24.45 | v42.41,10.62 37.61,10.62 31.09,17.13 v31.09,22.85
SCL
  Top 0.229: 35.15,38.68 33.61,37.13 IC1.28 | 35.15,38.68 36.12,39.65 36.46,39.65 RC5.2 | 39.26,35.36 38.63,34.73 37.95,34.73 37.15,35.53 37.15,36.68 35.15,38.68 | 39.26,35.36 39.32,35.42 39.32,36.9 U$8.3 | JP1.4 46.75,25.25 46.75,25.82 42.86,29.7 42.86,32.56 40.12,35.3 39.32,35.3 39.26,35.36
SDA  (via drill 0.36)
  Top 0.229: v35.21,37.59 34.18,36.56 IC1.27 | v36.23,38.62 37.49,38.62 38.52,39.65 RC4.2 38.63,39.65 40.58,37.7 40.58,37.02 U$8.2 40.69,36.9 40.69,35.88 43.32,33.25 43.32,31.88 46.75,28.45 46.75,27.76 JP1.5
  Bottom 0.229: v36.23,38.62 v35.21,37.59
TXD  (via drill 0.36)
  Top 0.229: v33.38,39.3 32.46,39.3 32.01,38.85 IC1.31 | Q2.1 42.29,41.25 43.78,41.25 45.26,39.76 45.26,37.82 45.04,37.59 45.04,36.9 46.52,35.42 46.75,35.42 JP1.8
  Bottom 0.229: v33.38,39.3 41.26,39.3 42.52,40.56 44.46,40.56 46.75,38.28 46.75,35.42 JP1.8
VBAT  (via drill 0.36)
  Top 0.305: 42.18,26.73 44.01,26.73 C12.+ | 42.18,26.73 41.95,26.73 41.26,26.05 v41.26,21.82 41.26,17.13 40.24,16.1 40.24,13.59 v36.01,9.36 | 42.18,26.73 v42.18,30.16 | 14.52,32.33 14.52,34.96 L1.P$1 | 14.52,32.33 14.52,32.1 U2.6 | 14.52,32.33 14.4,32.33 13.03,30.96 13.03,30.62 12.57,30.16 12.12,30.16 U2.3 11.89,30.16 10.17,30.16 C8.1 9.95,30.05 8.69,28.79 R5.2 8.57,28.45 8.57,26.73 2.8,20.96 | D11.1 3.09,34.05 2.06,34.05 C1.+ | 2.8,20.96 2.06,21.7 C10.+ | 2.8,20.96 3.32,20.45 3.32,10.96 2.06,9.7 2.06,9.36 C11.+
  Bottom 0.305: v41.26,21.82 44.01,19.07 44.01,14.39 C14.+ | v42.18,30.16 42.18,34.16 44.01,35.99 44.01,39.3 C13.+ | C1.+ 2.06,33.93 2.06,28.56 3.32,27.3 3.32,23.07 2.06,21.82 C10.+ | v36.01,9.36 2.06,9.36 C11.+
VCC  (via drill 0.36)
  Top 0.254: 26.4,36.56 IC1.6 26.4,36.45 v27.2,35.65 27.43,35.42 27.43,34.39 v27.55,34.28 31.89,29.93 IC1.18 | RC5.1 36.58,41.48 38.52,41.48 RC4.1 38.63,41.36 39.66,41.36 | 39.66,41.36 40.24,41.36 Q2.2 | 33.38,41.36 32.35,41.36 30.29,39.3 30.29,38.96 28.46,37.13 | 33.38,41.36 34.52,41.36 RRST.2 | 28.46,37.13 28,37.13 27.55,37.59 IC1.4 27.43,37.7 | v39.66,40.1 39.66,41.36 | v33.38,41.25 33.38,41.36 | v28.81,35.65 28.81,36.68 28.46,37.02 28.46,37.13 | R3.2 16.23,31.88 15.89,31.88 15.09,31.07 14.63,31.07 U2.5 14.52,30.96 14.06,30.96 13.6,30.5 13.6,29.59 13.77,29.42 | 13.77,29.42 13.95,29.25 16.92,29.25 17.95,30.28 C7.1 18.06,30.28 19.66,30.28 19.78,30.16 C9.1 19.89,30.16 v20.8,31.07 | SPEAKER.2 8.12,13.93 8.46,13.59 8.46,11.87 U$6.+ 8.57,11.76 9.72,10.62 v10.17,10.62 | v39.21,13.82 36.46,11.07 35.32,11.07 v34.86,10.62 | v13.49,29.13 13.77,29.42
  Bottom 0.254: v39.66,40.1 34.52,40.1 v33.38,41.25 | v28.81,35.65 v27.2,35.65 | 46.52,13.13 U$1.2 46.41,13.13 43.44,13.13 42.75,13.82 v39.21,13.82 | v10.17,10.62 v34.86,10.62 | v13.49,29.13 13.49,23.88 10.63,21.02 10.63,13.02 10.29,12.67 9.37,12.67 8.12,13.93 SPEAKER.2 | v27.55,34.28 24,34.28 v20.8,31.07
VCC2  (via drill 0.36)
  Top 0.229: v42.41,39.19 41.38,39.19 Q2.3 | v38.75,38.5 38.75,38.16 38.18,37.59 38.18,37.02 U$8.4 38.18,36.9 38.18,35.53 v38.29,35.42 | v40.01,28.79 40.01,27.42 40.46,26.96 v40.46,23.65
  Bottom 0.229: v42.41,39.19 41.84,39.19 41.15,38.5 v38.75,38.5 | v38.29,35.42 38.29,33.82 40.01,32.1 v40.01,28.79 | v40.46,23.65 46.52,17.59 46.75,17.59 JP1.1
VUSB  (via drill 0.36)
  Top 0.229: RC6.2 19.78,41.59 19.55,41.59 17.83,39.88 IC2.4 17.83,39.76 17.83,39.19 18.52,38.5 18.52,37.7 17.32,36.5 | 17.32,36.5 16.58,37.25 PWR1.1 16.46,37.25 v14.52,37.25 | 17.32,36.5 17.95,35.88 17.95,35.65 C3.1 | v6.63,29.36 5.26,29.36 USB2.VBUS
  Bottom 0.229: v14.52,37.25 v6.63,29.36

### Text on the board
tNames: rprog | +2.5V | Charge | 10k 4k7 4k7 | 1k | 4.7uH | TX | Atmega | SHT | 1640 | RX | RST | SDA | SCL | GND | A3 | VCC | MISO | MENU | SELECT | SCK | RES
bNames: 3.3V | MOSI | GND